# EAGLE design tive-c-dev-shield (EAGLE 6.5.0)

## Sheet 1 of 3: BoosterPack Interface
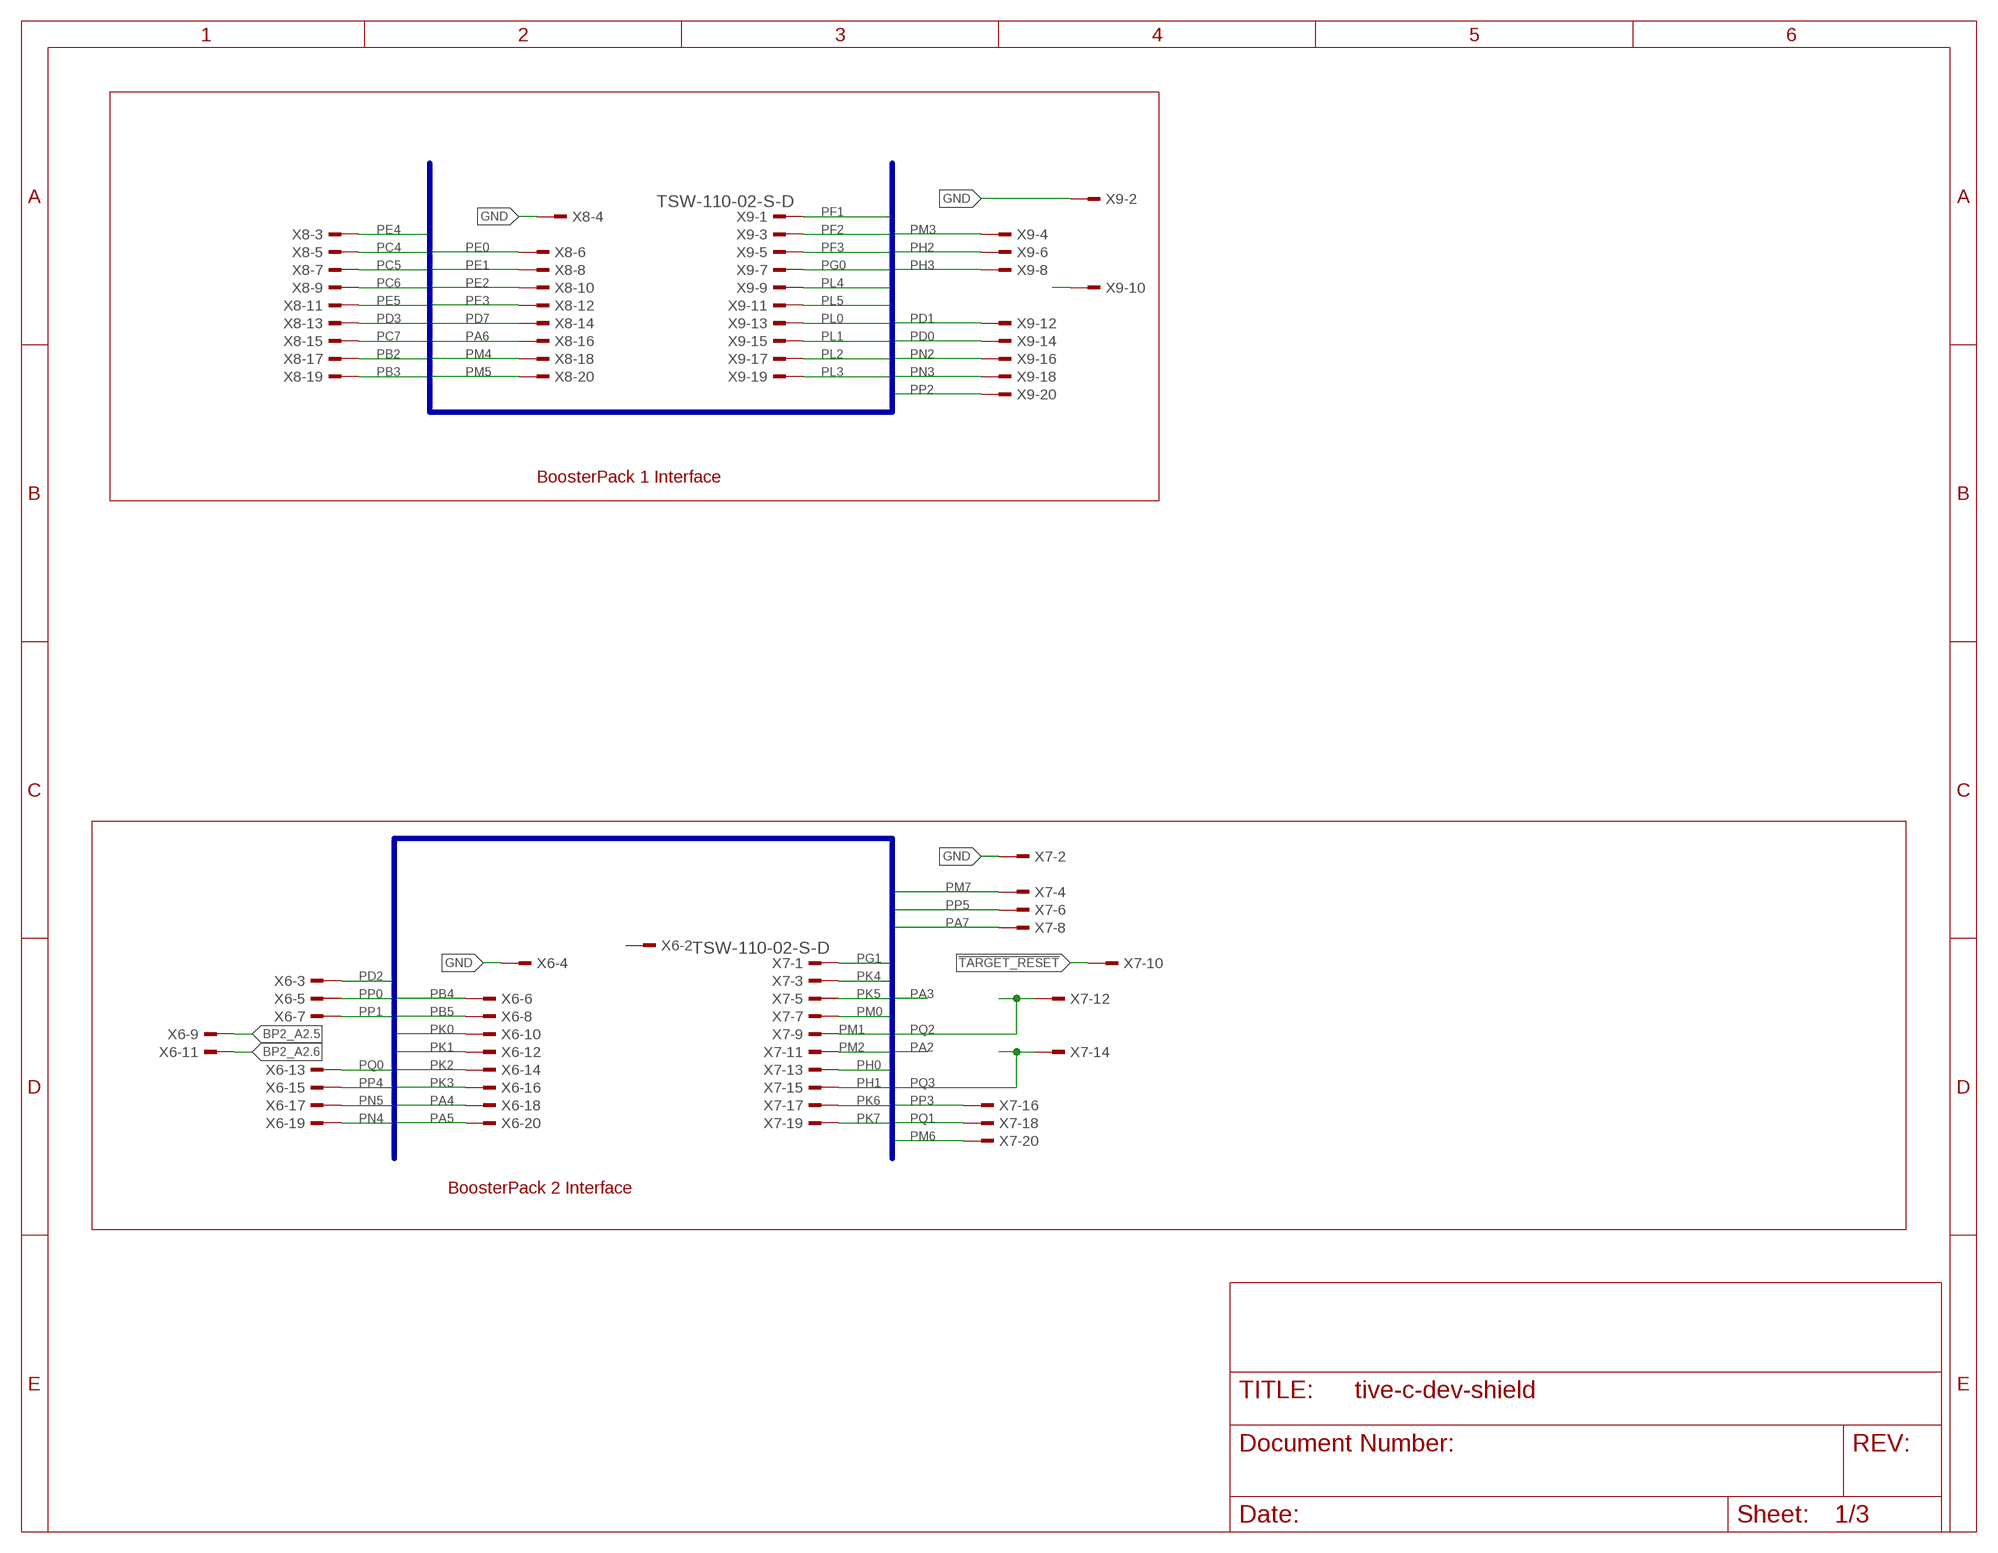
[diagram p0: schematic, sheet 1]

### Parts
X6  TSW-110-02-S-D  [TSW-110-02-S-D]
X7  TSW-110-02-S-D  [TSW-110-02-S-D]
X8  TSW-110-02-S-D  [TSW-110-02-S-D]
X9  TSW-110-02-S-D  [TSW-110-02-S-D]

### Nets
!TARGET_RESET: X7.10 X9.10
BP2_A2.5: X6.9
BP2_A2.6: X6.11
GND: X6.4 X7.2 X8.4 X9.2 ; also sheet 3
PA4: X6.18
PA5: X6.20
PA6: X8.16
PA7: X7.8
PB2: X8.17
PB3: X8.19
PB4: X6.6
PB5: X6.8
PC4: X8.5
PC5: X8.7
PC6: X8.9
PC7: X8.15
PD0: X9.14
PD1: X9.12
PD2: X6.3
PD3: X8.13
PD7: X8.14
PE0: X8.6
PE1: X8.8
PE2: X8.10
PE3: X8.12
PE4: X8.3
PE5: X8.11
PF1: X9.1
PF2: X9.3
PF3: X9.5
PG0: X9.7
PG1: X7.1
PH0: X7.13
PH1: X7.15
PH2: X9.6
PH3: X9.8
PK0: X6.10
PK1: X6.12
PK2: X6.14
PK3: X6.16
PK4: X7.3
PK5: X7.5
PK6: X7.17
PK7: X7.19
PL0: X9.13
PL1: X9.15
PL2: X9.17
PL3: X9.19
PL4: X9.9
PL5: X9.11
PM0: X7.7
PM1: X7.9
PM2: X7.11
PM3: X9.4
PM4: X8.18
PM5: X8.20
PM6: X7.20
PM7: X7.4
PN2: X9.16
PN3: X9.18
PN4: X6.19
PN5: X6.17
PP0: X6.5
PP1: X6.7
PP2: X9.20
PP3: X7.16
PP4: X6.15
PP5: X7.6
PQ0: X6.13
PQ1: X7.18
PQ2: X7.12
PQ3: X7.14
Unconnected: X6.1 X6.2 X8.1 X8.2

### Buses
GPIO:PA[0..7],PB[0..5],PC[0..7],PD[0..7],PE[0..5],PF[0..4],PG[0..1],PH[0..3],PJ[0..1],PK[0..7],PL[0..7],PM[0..7],PN[0..5],PP[0..5],PQ[0..4]

### Notes on the sheet
- BoosterPack 1 Interface
- BoosterPack 2 Interface

## Sheet 2 of 3: Power
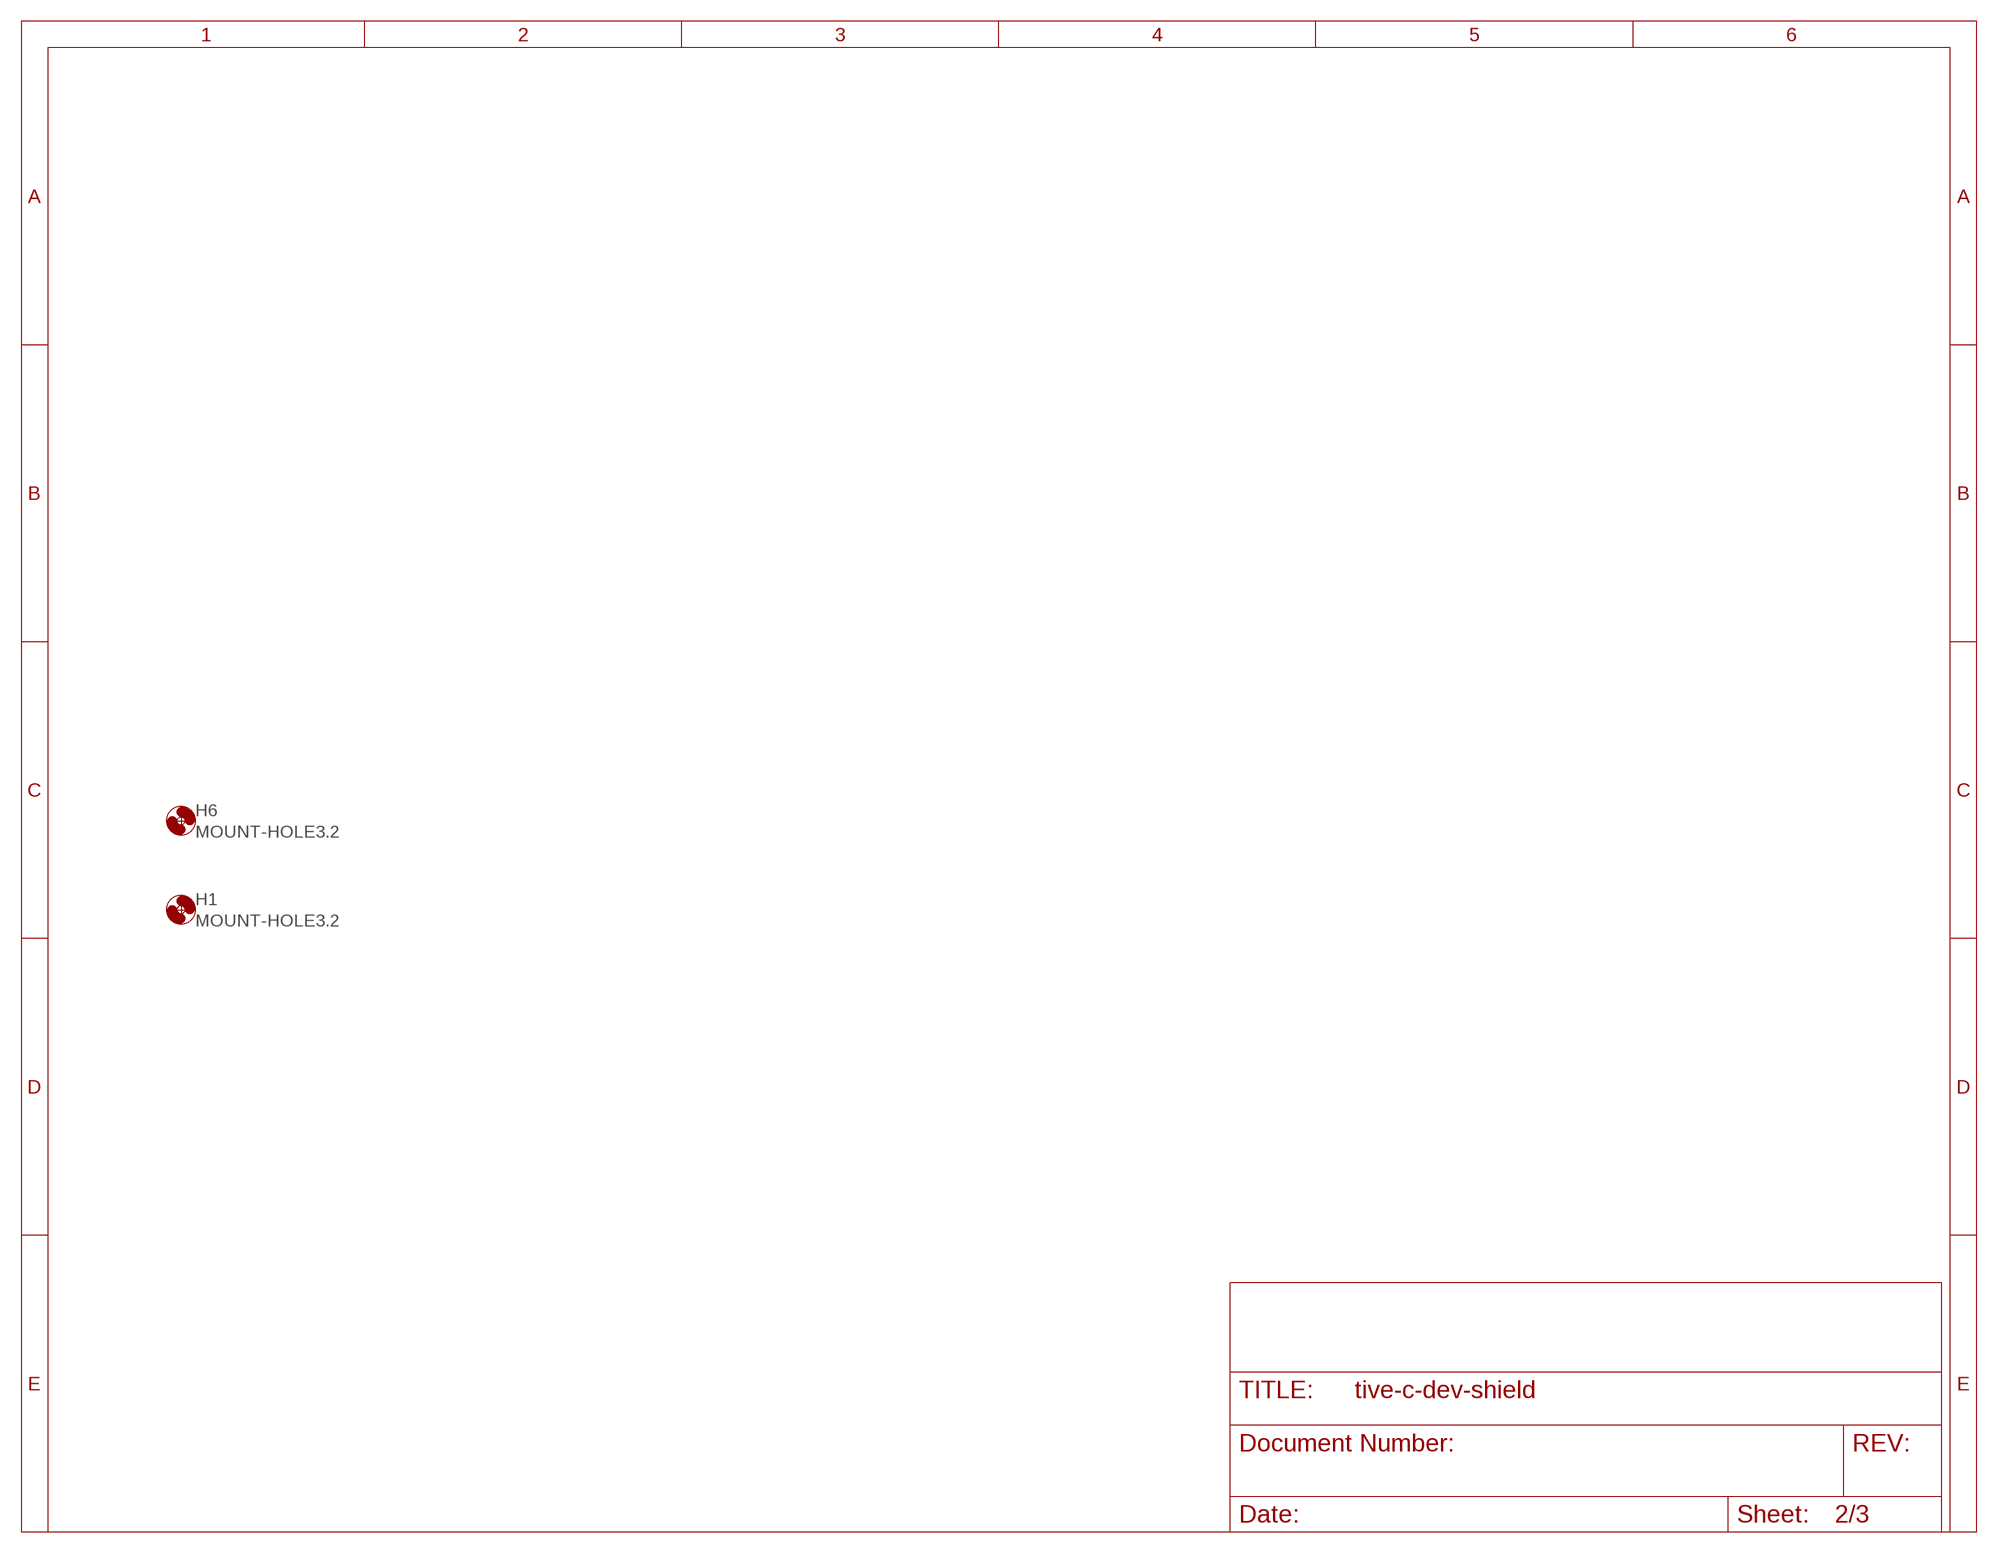
[diagram p1: schematic, sheet 2]

### Parts
H1  MOUNT-HOLE3.2  [3,2]
H6  MOUNT-HOLE3.2  [3,2]

## Sheet 3 of 3: OUTPUT PORTS
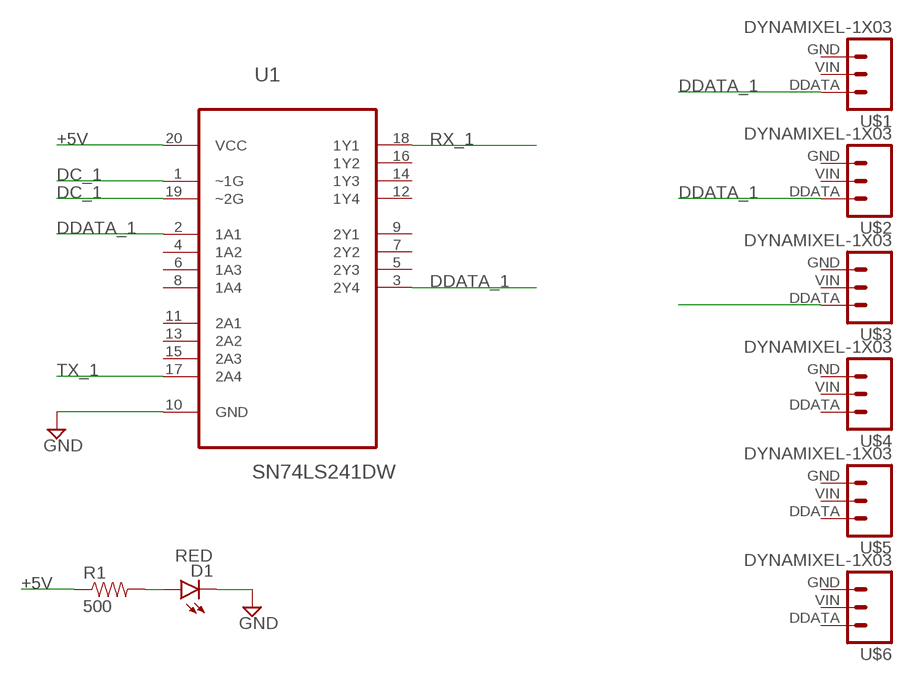
[diagram p2: schematic, sheet 3]

### Parts
D1  RED  LED-RED1206  [LED-1206]
R1  500  RESISTOR1206  [1206]
U1  SN74LS241DW  [SOIC127P1030X265-20N]
U$1  DYNAMIXEL-1X03  [DYNAMIXEL-1X03]
U$2  DYNAMIXEL-1X03  [DYNAMIXEL-1X03]
U$3  DYNAMIXEL-1X03  [DYNAMIXEL-1X03]
U$4  DYNAMIXEL-1X03  [DYNAMIXEL-1X03]
U$5  DYNAMIXEL-1X03  [DYNAMIXEL-1X03]
U$6  DYNAMIXEL-1X03  [DYNAMIXEL-1X03]

### Nets
+5V: R1.1 U1.20(VCC)
DC_1: U1.1(~1G) U1.19(~2G)
DDATA_1: U1.2(1A1) U1.3(2Y4) U$1.DDATA U$2.DDATA
GND: D1.C U1.10(GND) ; also sheet 1
N$3: D1.A R1.2
N$4: U$3.DDATA
RX_1: U1.18(1Y1)
TX_1: U1.17(2A4)
Unconnected: U1.4(1A2) U1.5(2Y3) U1.6(1A3) U1.7(2Y2) U1.8(1A4) U1.9(2Y1) U1.11(2A1) U1.12(1Y4) U1.13(2A2) U1.14(1Y3) U1.15(2A3) U1.16(1Y2) U$1.GND U$1.VIN U$2.GND U$2.VIN U$3.GND U$3.VIN U$4.DDATA U$4.GND U$4.VIN U$5.DDATA U$5.GND U$5.VIN U$6.DDATA U$6.GND U$6.VIN

## Library data of the parts
D1 = SparkFun-LED:LED-RED: Assorted Red LEDs LilyPad 1206- DIO-09912 1206- DIO-00809 0603- DIO-00819; PROD_ID: DIO-00809
H1 H6 = holes:MOUNT-HOLE: MOUNTING HOLE with drill center marker; GNUM: G30-62S04-A112-AAA; POPOP: OMIT
R1 = SparkFun-Passives:RESISTOR: Resistor Basic schematic elements and footprints for 0603, 1206, and PTH resistors.
U1 = MRDT-2015-Arm:SN74LS241DW: OCTAL BUFFERS AND LINE DRIVERS WITH 3-STATE OUTPUTS; MPN: SN74LS241DW; OC_FARNELL: 1739687; OC_NEWARK: 50R6539; PACKAGE: SOIC-20; SUPPLIER: Texas Instruments
U$1-U$6 = MRDT-2015-Arm:DYNAMIXEL-1X03
X6-X9 = ek-tm4c129exl:TSW-110-02-S-D: THROUGH-HOLE .025" SQ POST HEADER Source: Samtec TSW.pdf; GNUM: G22-THSTK-2X10-BAC; OC_FARNELL: unknown; OC_NEWARK: unknown

## Net classes
1 USB: width 0.275 mm, clearance 0.152 mm
2 Ethernet: width 0.22 mm, clearance 0.152 mm

## Board
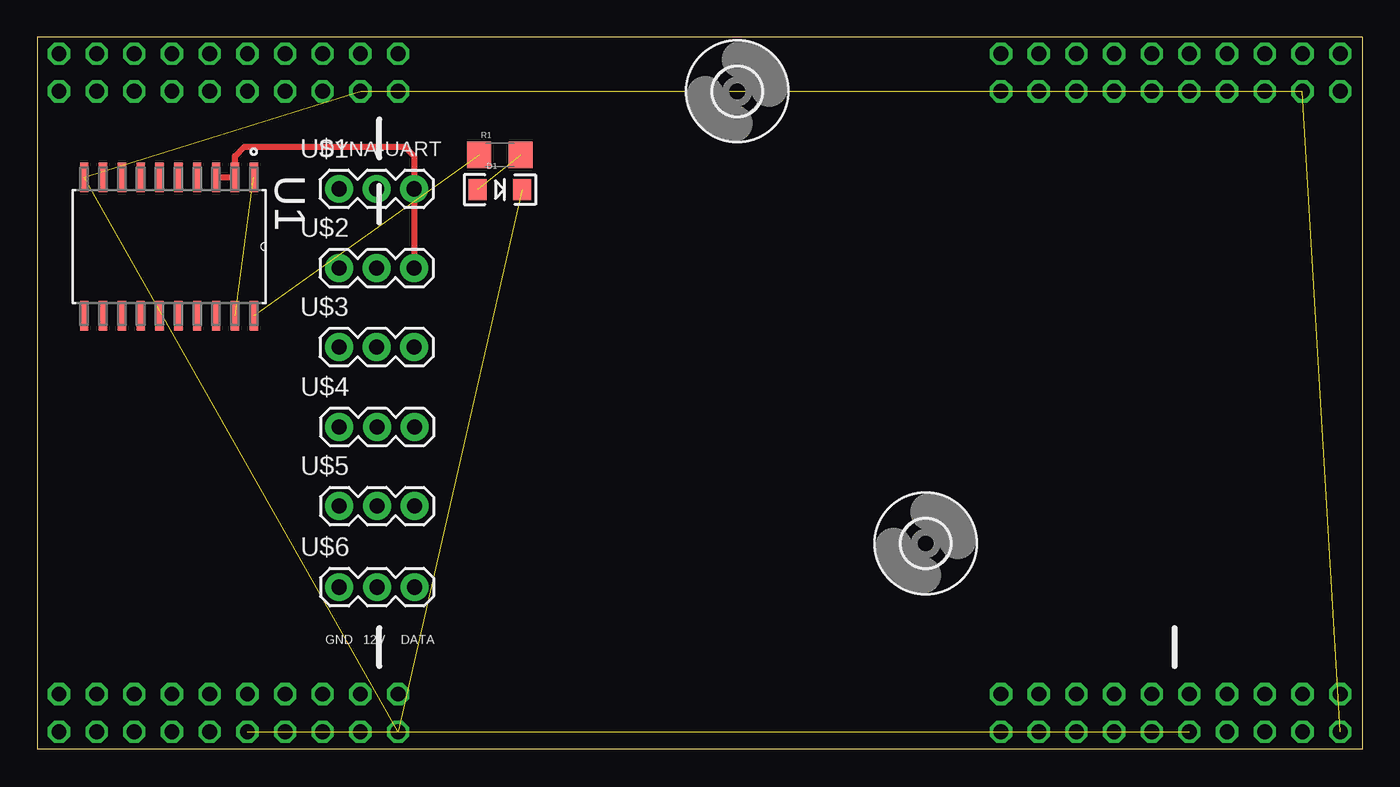
[diagram p3: board, top side]
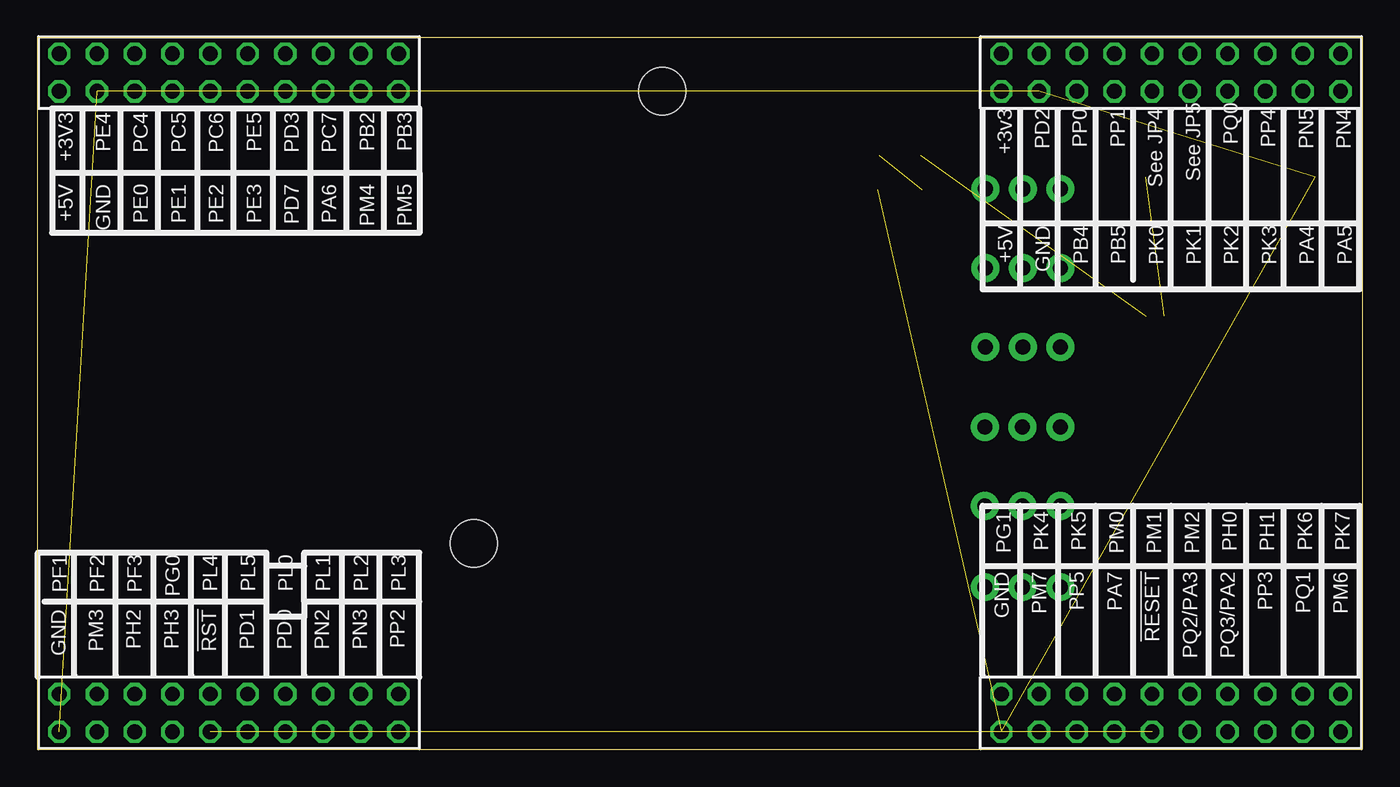
[diagram p4: board, bottom side, seen from below]

Size 89.33 x 48.03 mm. Coordinates in mm from the lower left corner, seen from the top.
Outline: 89.33,48.03 89.33,0 0,0 0,48.03 89.33,48.03
Copper layers (1+2*15+16): Top 0.035mm / dielectric 0.22mm / Route2 0.035mm / dielectric 1mm / Route15 0.035mm / dielectric 0.22mm / Bottom 0.035mm
Design rules "default *": minimum track width 6mil, minimum drill 12mil, track to track 6mil, track to pad 6mil, pad to pad 5mil, via to via 6mil, smd to smd 5mil, copper to edge 10mil, drill to drill 8mil, minimum pad ring 4mil, minimum via ring 8mil, stop-mask expansion 2mil, vias tented up to drill 13mil, thermal gap 8mil

### Footprints (pad centres in the part's own frame; a part is rotated, then mirrored left to right if it is on the bottom)
LED-1206 = smd 1.2 x 1.4: A -1.5,0; C 1.5,0
3,2 = hole 3.2: 0,0
1206 = smd 1.6 x 1.8: 1 -1.4,0; 2 1.4,0
SOIC127P1030X265-20N = smd 1.981 x 0.559: 1 -4.674,5.715; 2 -4.674,4.445; 3 -4.674,3.175; 4 -4.674,1.905; 5 -4.674,0.635; 6 -4.674,-0.635; 7 -4.674,-1.905; 8 -4.674,-3.175; 9 -4.674,-4.445; 10 -4.674,-5.715; 11 4.674,-5.715; 12 4.674,-4.445; 13 4.674,-3.175; 14 4.674,-1.905; 15 4.674,-0.635; 16 4.674,0.635; 17 4.674,1.905; 18 4.674,3.175; 19 4.674,4.445; 20 4.674,5.715
DYNAMIXEL-1X03 = drill 1.016 pad 1.88: DDATA 5.08,0; GND 0,0; VIN 2.54,0
TSW-110-02-S-D = drill 1 pad 1.5 octagon: 1 11.43,-1.27; 2 11.43,1.27; 3 8.89,-1.27; 4 8.89,1.27; 5 6.35,-1.27; 6 6.35,1.27; 7 3.81,-1.27; 8 3.81,1.27; 9 1.27,-1.27; 10 1.27,1.27; 11 -1.27,-1.27; 12 -1.27,1.27; 13 -3.81,-1.27; 14 -3.81,1.27; 15 -6.35,-1.27; 16 -6.35,1.27; 17 -8.89,-1.27; 18 -8.89,1.27; 19 -11.43,-1.27; 20 -11.43,1.27

### Placement (x,y rotation side)
D1  31.19,37.74 0 top
H1  59.89,13.89 0 top
H6  47.19,44.37 0 top
R1  31.19,40.08 0 top
U1  8.89,33.91 270 top
U$1  20.35,37.8 0 top
U$2  20.35,32.46 0 top
U$3  20.35,27.13 0 top
U$4  20.37,21.74 0 top
U$5  20.37,16.41 0 top
U$6  20.37,10.95 0 top
X6  12.9,45.64 180 bottom
X7  12.9,2.46 180 bottom
X8  76.4,45.64 180 bottom
X9  76.4,2.46 180 bottom

### Tracks (layer width: path | path; a pad name or v marks a point on that pad's centre or on a via)
!TARGET_RESET  (1 unrouted)
+5V  (1 unrouted)
DC_1  (1 unrouted)
DDATA_1
  Top 0.406: U1.3 U1.2 13.34,40.01 13.97,40.64 24.77,40.64 25.4,40.01 25.4,37.82 U$1.DDATA U$2.DDATA
GND  (5 unrouted)
N$3  (1 unrouted)

### Text on the board
tPlace: DYNA-UART | GND | 12V | DATA
bNames: +3v3 / PD2 / PP0 / PP1 / See JP4 / See JP5 / PQ0 / PP4 / PN5 / PN4 | +3V3 / PE4 / PC4 / PC5 / PC6 / PE5 / PD3 / PC7 / PB2 / PB3 | +5V / GND / PE0 / PE1 / PE2 / PE3 / PD7 / PA6 / PM4 / PM5 | +5V / GND / PB4 / PB5 / PK0 / PK1 / PK2 / PK3 / PA4 / PA5 | PG1 / PK4 / PK5 / PM0 / PM1 / PM2 / PH0 / PH1 / PK6 / PK7 | PF1 / PF2 / PF3 / PG0 / PL4 / PL5 / PL0 / PL1 / PL2 / PL3 | GND / PM7 / PP5 / PA7 / !RESET / PQ2/PA3 / PQ3/PA2 / PP3 / PQ1 / PM6 | GND / PM3 / PH2 / PH3 / !RST / PD1 / PD0 / PN2 / PN3 / PP2
Document: Layer Stackup / Top silkscreen / Top Solder Mask / Component Side / Layer 2 / Layer 3 / Solder Side / Bottom Solder Mask / Bottom Silkscreen | File Names / EK-TM4C129EXL.sst / EK-TM4C129EXL.smt / EK-TM4C129EXL.l1 / EK-TM4C129EXL.l2 / EK-TM4C129EXL.l3 / EK-TM4C129EXL.l4 / EK-TM4C129EXL.smb / EK-TM4C129EXL.ssb | NOTES: UNLESS OTHERWISE SPECIFIED / 1) Manufacture in accordance with IPC-6012, Type 3, Class 2. / 2) End Product Features shall not vary more than 20% from artwork originals / 3) Material shall be ROHS compliant, copper clad FR-406, NEMA Grade (Tg 170degC) / Per IPC-4101, Color Natural, or equivalent / 4) Construction shall be symetrical multilayer per layer stackup detail / 5) Copper weight on inner layers shall be 1 oz per square foot / 6) Equivalent copper weight on outler layers shall be 1.0 oz per square foot before plating / 7) All plated through holes shall have a minimum of 0.0007 inches of copper / 8) Drill hole tolerance after plating shall be +/- 0.003 inches / 9) Minimum annular ring shall be 0.001 inches / 10) Minmum annular rint at emergent conductors shall be 0.003 inches / 11) PCB Thickness shall be 0.062 inches +/- 0.007 inches / 12) Warp / Twist shall not exceed 0.010 inches per inch / 13) Finish shall be LPI, Gloss RED SMOBC, Both sides balance of exposed copper shall be HASL / 14) Silkscreen with nonconductive white epoxy ink / 15) Board stack-up should be targetted such that a differential impedance of 90 ohms +/- 10% can / be achieved on the top layer with 10.8 mil traces and 6 mil spacing. Additionally 100 ohm +/- 10% / with 8.7 mil traces and 6 mil spacing. Boards do not need to be impedance controlled.